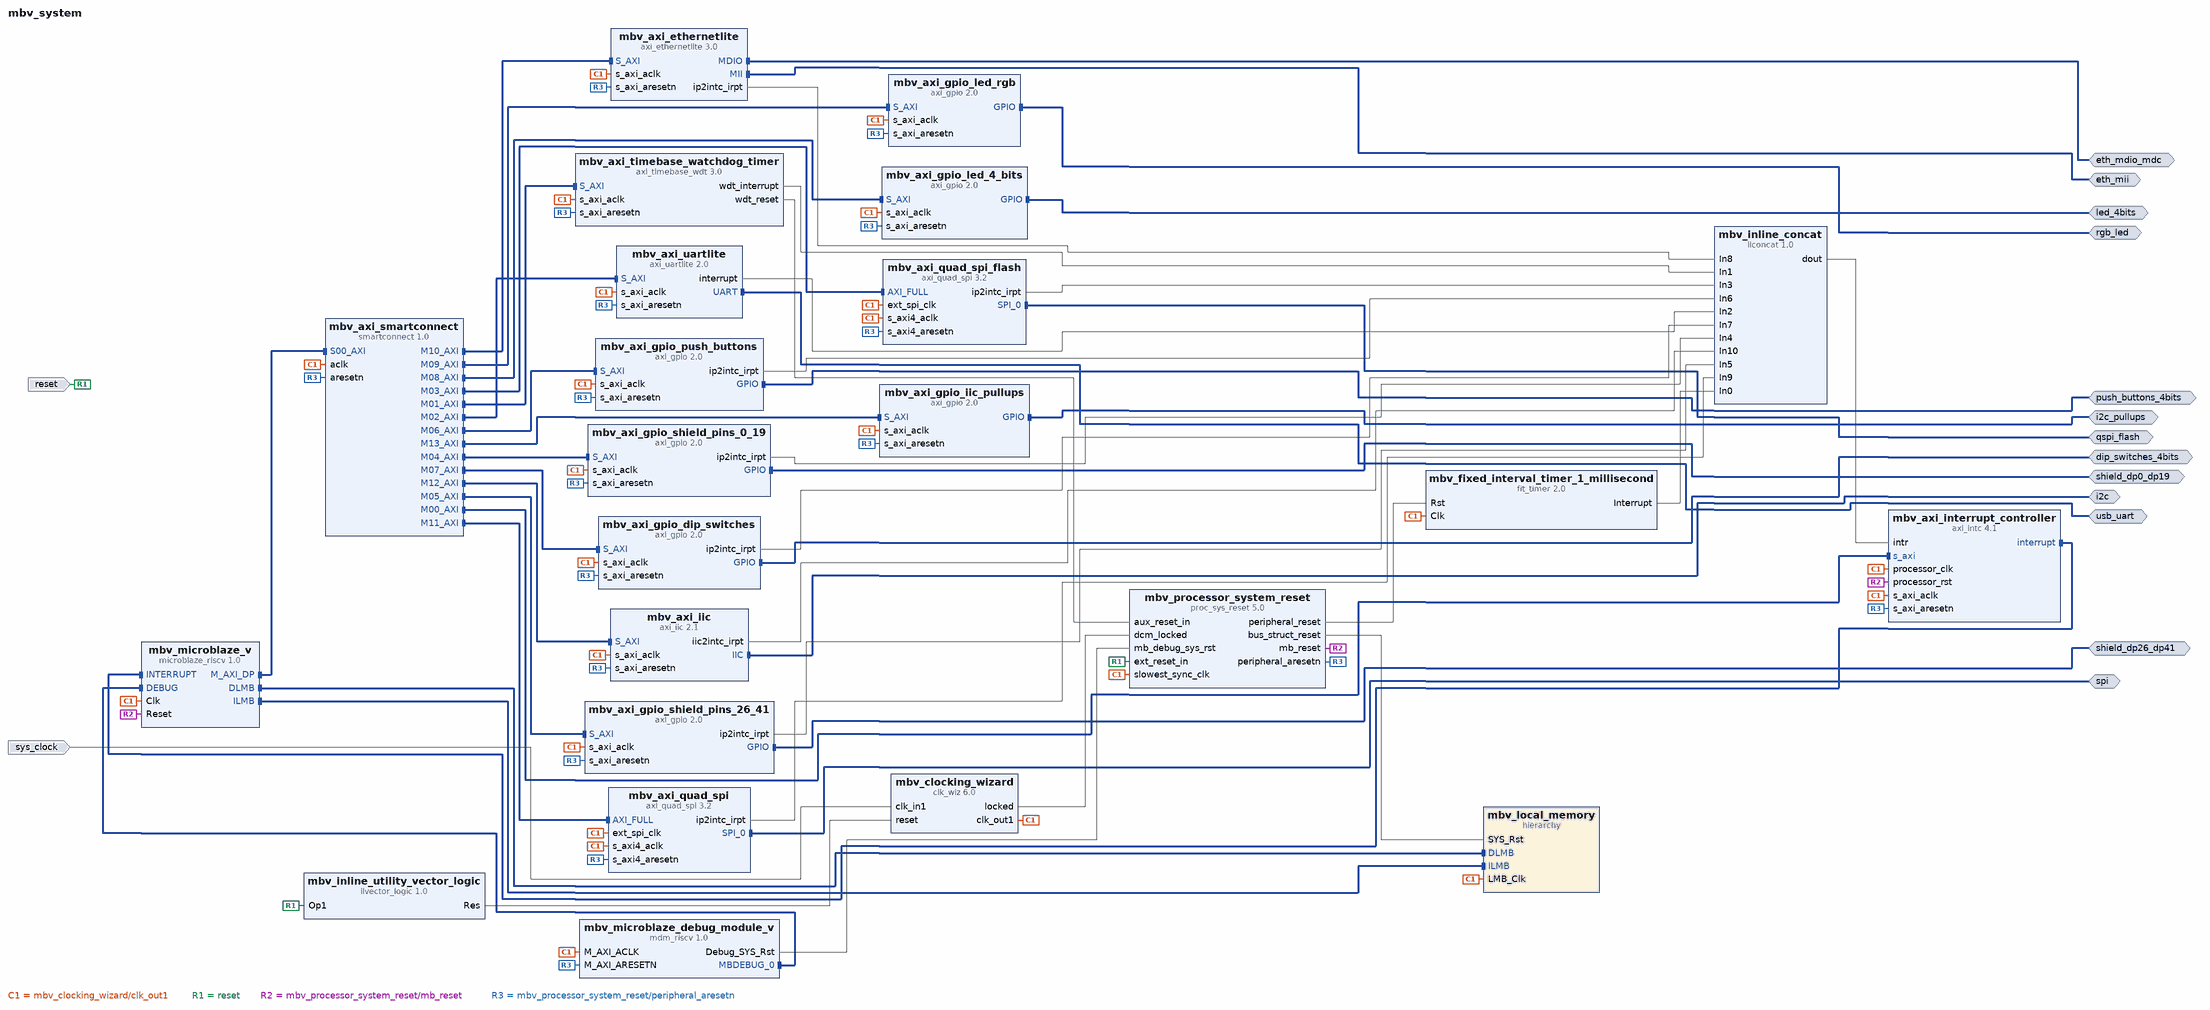
[diagram p0: block diagram of the top level]
# Vivado block design mbv_system, xc7a35ticsg324-1L, Vivado 2025.2
create_bd_design mbv_system

create_bd_intf_port -mode Master -vlnv xilinx.com:interface:uart_rtl:1.0 usb_uart
create_bd_intf_port -mode Master -vlnv xilinx.com:interface:spi_rtl:1.0 qspi_flash
create_bd_intf_port -mode Master -vlnv xilinx.com:interface:gpio_rtl:1.0 shield_dp0_dp19
create_bd_intf_port -mode Master -vlnv xilinx.com:interface:gpio_rtl:1.0 shield_dp26_dp41
create_bd_intf_port -mode Master -vlnv xilinx.com:interface:gpio_rtl:1.0 push_buttons_4bits
create_bd_intf_port -mode Master -vlnv xilinx.com:interface:gpio_rtl:1.0 dip_switches_4bits
create_bd_intf_port -mode Master -vlnv xilinx.com:interface:gpio_rtl:1.0 led_4bits
create_bd_intf_port -mode Master -vlnv xilinx.com:interface:gpio_rtl:1.0 rgb_led
create_bd_intf_port -mode Master -vlnv xilinx.com:interface:mii_rtl:1.0 eth_mii
create_bd_intf_port -mode Master -vlnv xilinx.com:interface:mdio_rtl:1.0 eth_mdio_mdc
create_bd_intf_port -mode Master -vlnv xilinx.com:interface:spi_rtl:1.0 spi
create_bd_intf_port -mode Master -vlnv xilinx.com:interface:iic_rtl:1.0 i2c
create_bd_intf_port -mode Master -vlnv xilinx.com:interface:gpio_rtl:1.0 i2c_pullups
create_bd_port -dir I -type clk sys_clock
set_property -dict {CONFIG.FREQ_HZ 100000000 CONFIG.PHASE 0.0} [get_bd_ports sys_clock]
create_bd_port -dir I -type rst reset
set_property -dict {CONFIG.POLARITY ACTIVE_LOW} [get_bd_ports reset]

create_bd_cell -type ip -vlnv xilinx.com:ip:microblaze_riscv:1.0 mbv_microblaze_v
set_property -dict [list \
  CONFIG.C_DEBUG_ENABLED 1 \
  CONFIG.C_DEBUG_EVENT_COUNTERS 13 \
  CONFIG.C_DEBUG_EXTERNAL_TRACE 1 \
  CONFIG.C_DEBUG_LATENCY_COUNTERS 8 \
  CONFIG.C_D_AXI 1 \
  CONFIG.C_D_LMB 1 \
  CONFIG.C_I_LMB 1 \
  CONFIG.C_NUMBER_OF_PC_BRK 8 \
  CONFIG.C_NUMBER_OF_RD_ADDR_BRK 4 \
  CONFIG.C_NUMBER_OF_WR_ADDR_BRK 4 \
  CONFIG.C_USE_ATOMIC 1 \
  CONFIG.C_USE_BITMAN_A 1 \
  CONFIG.C_USE_BITMAN_B 1 \
  CONFIG.C_USE_BITMAN_C 1 \
  CONFIG.C_USE_BITMAN_S 1 \
  CONFIG.C_USE_COMPRESSION 1 \
  CONFIG.C_USE_FPU 0 \
  CONFIG.C_USE_MMU 3 \
  CONFIG.C_USE_MULDIV 2 \
] [get_bd_cells mbv_microblaze_v]
create_bd_cell -type hier mbv_local_memory
create_bd_cell -type ip -vlnv xilinx.com:ip:smartconnect:1.0 mbv_axi_smartconnect
set_property -dict {CONFIG.NUM_MI 14 CONFIG.NUM_SI 1} [get_bd_cells mbv_axi_smartconnect]
create_bd_cell -type ip -vlnv xilinx.com:ip:axi_intc:4.1 mbv_axi_interrupt_controller
set_property -dict {CONFIG.C_HAS_FAST 1} [get_bd_cells mbv_axi_interrupt_controller]
create_bd_cell -type inline_hdl -vlnv xilinx.com:inline_hdl:ilconcat:1.0 mbv_inline_concat
set_property -dict {CONFIG.NUM_PORTS 11} [get_bd_cells mbv_inline_concat]
create_bd_cell -type ip -vlnv xilinx.com:ip:mdm_riscv:1.0 mbv_microblaze_debug_module_v
set_property -dict [list \
  CONFIG.C_ADDR_SIZE 34 \
  CONFIG.C_M_AXI_ADDR_WIDTH 34 \
  CONFIG.C_TRACE_DATA_WIDTH 16 \
  CONFIG.C_TRACE_OUTPUT 1 \
] [get_bd_cells mbv_microblaze_debug_module_v]
create_bd_cell -type ip -vlnv xilinx.com:ip:clk_wiz:6.0 mbv_clocking_wizard
set_property -dict [list \
  CONFIG.CLKOUT1_JITTER 226.435 \
  CONFIG.CLKOUT1_PHASE_ERROR 236.795 \
  CONFIG.CLKOUT1_REQUESTED_OUT_FREQ 75 \
  CONFIG.CLK_IN1_BOARD_INTERFACE sys_clock \
  CONFIG.MMCM_CLKFBOUT_MULT_F 40.125 \
  CONFIG.MMCM_CLKOUT0_DIVIDE_F 13.375 \
  CONFIG.MMCM_DIVCLK_DIVIDE 4 \
  CONFIG.PRIM_SOURCE Single_ended_clock_capable_pin \
  CONFIG.RESET_BOARD_INTERFACE reset \
  CONFIG.USE_BOARD_FLOW true \
] [get_bd_cells mbv_clocking_wizard]
create_bd_cell -type ip -vlnv xilinx.com:ip:proc_sys_reset:5.0 mbv_processor_system_reset
set_property -dict {CONFIG.RESET_BOARD_INTERFACE reset CONFIG.USE_BOARD_FLOW true} [get_bd_cells mbv_processor_system_reset]
create_bd_cell -type inline_hdl -vlnv xilinx.com:inline_hdl:ilvector_logic:1.0 mbv_inline_utility_vector_logic
set_property -dict {CONFIG.C_OPERATION not CONFIG.C_SIZE 1} [get_bd_cells mbv_inline_utility_vector_logic]
create_bd_cell -type ip -vlnv xilinx.com:ip:fit_timer:2.0 mbv_fixed_interval_timer_1_millisecond
set_property -dict {CONFIG.C_NO_CLOCKS 75000} [get_bd_cells mbv_fixed_interval_timer_1_millisecond]
create_bd_cell -type ip -vlnv xilinx.com:ip:axi_timebase_wdt:3.0 mbv_axi_timebase_watchdog_timer
set_property -dict {CONFIG.ENABLE_WINDOW_WDT 1} [get_bd_cells mbv_axi_timebase_watchdog_timer]
create_bd_cell -type ip -vlnv xilinx.com:ip:axi_uartlite:2.0 mbv_axi_uartlite
set_property -dict [list \
  CONFIG.C_BAUDRATE 115200 \
  CONFIG.UARTLITE_BOARD_INTERFACE usb_uart \
  CONFIG.USE_BOARD_FLOW true \
] [get_bd_cells mbv_axi_uartlite]
create_bd_cell -type ip -vlnv xilinx.com:ip:axi_quad_spi:3.2 mbv_axi_quad_spi_flash
set_property -dict [list \
  CONFIG.C_FIFO_DEPTH 256 \
  CONFIG.C_SPI_MEMORY 3 \
  CONFIG.C_TYPE_OF_AXI4_INTERFACE 1 \
  CONFIG.C_XIP_MODE 0 \
  CONFIG.QSPI_BOARD_INTERFACE qspi_flash \
  CONFIG.USE_BOARD_FLOW true \
] [get_bd_cells mbv_axi_quad_spi_flash]
create_bd_cell -type ip -vlnv xilinx.com:ip:axi_gpio:2.0 mbv_axi_gpio_shield_pins_0_19
set_property -dict [list \
  CONFIG.GPIO_BOARD_INTERFACE shield_dp0_dp19 \
  CONFIG.USE_BOARD_FLOW true \
] [get_bd_cells mbv_axi_gpio_shield_pins_0_19]
create_bd_cell -type ip -vlnv xilinx.com:ip:axi_gpio:2.0 mbv_axi_gpio_shield_pins_26_41
set_property -dict [list \
  CONFIG.C_INTERRUPT_PRESENT 1 \
  CONFIG.GPIO_BOARD_INTERFACE shield_dp26_dp41 \
  CONFIG.USE_BOARD_FLOW true \
] [get_bd_cells mbv_axi_gpio_shield_pins_26_41]
create_bd_cell -type ip -vlnv xilinx.com:ip:axi_gpio:2.0 mbv_axi_gpio_push_buttons
set_property -dict [list \
  CONFIG.C_INTERRUPT_PRESENT 1 \
  CONFIG.GPIO_BOARD_INTERFACE push_buttons_4bits \
  CONFIG.USE_BOARD_FLOW true \
] [get_bd_cells mbv_axi_gpio_push_buttons]
create_bd_cell -type ip -vlnv xilinx.com:ip:axi_gpio:2.0 mbv_axi_gpio_dip_switches
set_property -dict [list \
  CONFIG.C_INTERRUPT_PRESENT 1 \
  CONFIG.GPIO_BOARD_INTERFACE dip_switches_4bits \
  CONFIG.USE_BOARD_FLOW true \
] [get_bd_cells mbv_axi_gpio_dip_switches]
create_bd_cell -type ip -vlnv xilinx.com:ip:axi_gpio:2.0 mbv_axi_gpio_led_4_bits
set_property -dict {CONFIG.GPIO_BOARD_INTERFACE led_4bits CONFIG.USE_BOARD_FLOW true} [get_bd_cells mbv_axi_gpio_led_4_bits]
create_bd_cell -type ip -vlnv xilinx.com:ip:axi_gpio:2.0 mbv_axi_gpio_led_rgb
set_property -dict {CONFIG.GPIO_BOARD_INTERFACE rgb_led CONFIG.USE_BOARD_FLOW true} [get_bd_cells mbv_axi_gpio_led_rgb]
create_bd_cell -type ip -vlnv xilinx.com:ip:axi_ethernetlite:3.0 mbv_axi_ethernetlite
set_property -dict [list \
  CONFIG.C_S_AXI_PROTOCOL AXI4LITE \
  CONFIG.MDIO_BOARD_INTERFACE eth_mdio_mdc \
  CONFIG.MII_BOARD_INTERFACE eth_mii \
  CONFIG.USE_BOARD_FLOW true \
] [get_bd_cells mbv_axi_ethernetlite]
create_bd_cell -type ip -vlnv xilinx.com:ip:axi_quad_spi:3.2 mbv_axi_quad_spi
set_property -dict [list \
  CONFIG.C_BYTE_LEVEL_INTERRUPT_EN 0 \
  CONFIG.C_FIFO_DEPTH 256 \
  CONFIG.C_NUM_TRANSFER_BITS 32 \
  CONFIG.C_SCK_RATIO 16 \
  CONFIG.C_SPI_MEMORY 3 \
  CONFIG.C_SPI_MODE 0 \
  CONFIG.C_TYPE_OF_AXI4_INTERFACE 1 \
  CONFIG.QSPI_BOARD_INTERFACE spi \
  CONFIG.USE_BOARD_FLOW true \
] [get_bd_cells mbv_axi_quad_spi]
create_bd_cell -type ip -vlnv xilinx.com:ip:axi_iic:2.1 mbv_axi_iic
set_property -dict [list \
  CONFIG.C_SCL_INERTIAL_DELAY 4 \
  CONFIG.C_SDA_INERTIAL_DELAY 4 \
  CONFIG.IIC_BOARD_INTERFACE i2c \
  CONFIG.USE_BOARD_FLOW true \
] [get_bd_cells mbv_axi_iic]
create_bd_cell -type ip -vlnv xilinx.com:ip:axi_gpio:2.0 mbv_axi_gpio_iic_pullups
set_property -dict {CONFIG.GPIO_BOARD_INTERFACE i2c_pullups CONFIG.USE_BOARD_FLOW true} [get_bd_cells mbv_axi_gpio_iic_pullups]

# ---- hierarchy /mbv_local_memory ----
current_bd_instance /mbv_local_memory
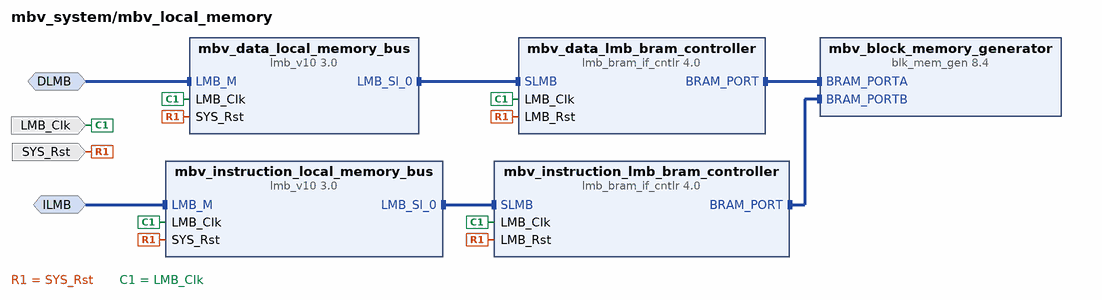
[diagram p1: block diagram inside /mbv_local_memory]
create_bd_intf_pin -mode MirroredMaster -vlnv xilinx.com:interface:lmb_rtl:1.0 DLMB
create_bd_intf_pin -mode MirroredMaster -vlnv xilinx.com:interface:lmb_rtl:1.0 ILMB
create_bd_pin -dir I -type clk LMB_Clk
create_bd_pin -dir I -type rst SYS_Rst

create_bd_cell -type ip -vlnv xilinx.com:ip:lmb_v10:3.0 mbv_data_local_memory_bus
create_bd_cell -type ip -vlnv xilinx.com:ip:lmb_v10:3.0 mbv_instruction_local_memory_bus
create_bd_cell -type ip -vlnv xilinx.com:ip:lmb_bram_if_cntlr:4.0 mbv_data_lmb_bram_controller
set_property -dict {CONFIG.C_ECC 0} [get_bd_cells mbv_data_lmb_bram_controller]
create_bd_cell -type ip -vlnv xilinx.com:ip:lmb_bram_if_cntlr:4.0 mbv_instruction_lmb_bram_controller
set_property -dict {CONFIG.C_ECC 0} [get_bd_cells mbv_instruction_lmb_bram_controller]
create_bd_cell -type ip -vlnv xilinx.com:ip:blk_mem_gen:8.4 mbv_block_memory_generator
set_property -dict [list \
  CONFIG.Memory_Type True_Dual_Port_RAM \
  CONFIG.use_bram_block BRAM_Controller \
] [get_bd_cells mbv_block_memory_generator]

# ---- connections ----

current_bd_instance /mbv_local_memory
connect_bd_intf_net -intf_net mbv_riscv_dlmb [get_bd_intf_pins mbv_data_local_memory_bus/LMB_M] [get_bd_intf_pins DLMB]
connect_bd_intf_net -intf_net mbv_riscv_dlmb_bus [get_bd_intf_pins mbv_data_local_memory_bus/LMB_Sl_0] [get_bd_intf_pins mbv_data_lmb_bram_controller/SLMB]
connect_bd_intf_net -intf_net mbv_riscv_dlmb_cntlr [get_bd_intf_pins mbv_data_lmb_bram_controller/BRAM_PORT] [get_bd_intf_pins mbv_block_memory_generator/BRAM_PORTA]
connect_bd_intf_net -intf_net mbv_riscv_ilmb [get_bd_intf_pins mbv_instruction_local_memory_bus/LMB_M] [get_bd_intf_pins ILMB]
connect_bd_intf_net -intf_net mbv_riscv_ilmb_bus [get_bd_intf_pins mbv_instruction_local_memory_bus/LMB_Sl_0] [get_bd_intf_pins mbv_instruction_lmb_bram_controller/SLMB]
connect_bd_intf_net -intf_net mbv_riscv_ilmb_cntlr [get_bd_intf_pins mbv_instruction_lmb_bram_controller/BRAM_PORT] [get_bd_intf_pins mbv_block_memory_generator/BRAM_PORTB]
connect_bd_net [get_bd_pins SYS_Rst] \
  [get_bd_pins mbv_data_local_memory_bus/SYS_Rst] [get_bd_pins mbv_data_lmb_bram_controller/LMB_Rst] \
  [get_bd_pins mbv_instruction_local_memory_bus/SYS_Rst] [get_bd_pins mbv_instruction_lmb_bram_controller/LMB_Rst]
connect_bd_net -net mbv_riscv_Clk [get_bd_pins LMB_Clk] \
  [get_bd_pins mbv_data_local_memory_bus/LMB_Clk] [get_bd_pins mbv_data_lmb_bram_controller/LMB_Clk] \
  [get_bd_pins mbv_instruction_local_memory_bus/LMB_Clk] [get_bd_pins mbv_instruction_lmb_bram_controller/LMB_Clk]
set_property HDL_ATTRIBUTE.BMM_INFO_ADDRESS_SPACE {byte  0x00000000 32 > mbv_system mbv_local_memory/mbv_block_memory_generator} [get_bd_cells mbv_data_lmb_bram_controller]
set_property HDL_ATTRIBUTE.KEEP_HIERARCHY yes [get_bd_cells mbv_data_lmb_bram_controller]

current_bd_instance /
connect_bd_intf_net -intf_net axi_ethernetlite_0_MDIO [get_bd_intf_ports eth_mdio_mdc] [get_bd_intf_pins mbv_axi_ethernetlite/MDIO]
connect_bd_intf_net -intf_net axi_ethernetlite_0_MII [get_bd_intf_ports eth_mii] [get_bd_intf_pins mbv_axi_ethernetlite/MII]
connect_bd_intf_net -intf_net axi_gpio_0_GPIO [get_bd_intf_ports shield_dp0_dp19] [get_bd_intf_pins mbv_axi_gpio_shield_pins_0_19/GPIO]
connect_bd_intf_net -intf_net axi_gpio_0_GPIO1 [get_bd_intf_ports push_buttons_4bits] [get_bd_intf_pins mbv_axi_gpio_push_buttons/GPIO]
connect_bd_intf_net -intf_net axi_gpio_0_GPIO2 [get_bd_intf_ports led_4bits] [get_bd_intf_pins mbv_axi_gpio_led_4_bits/GPIO]
connect_bd_intf_net -intf_net axi_gpio_0_GPIO3 [get_bd_intf_ports rgb_led] [get_bd_intf_pins mbv_axi_gpio_led_rgb/GPIO]
connect_bd_intf_net -intf_net axi_iic_0_IIC [get_bd_intf_ports i2c] [get_bd_intf_pins mbv_axi_iic/IIC]
connect_bd_intf_net -intf_net axi_quad_spi_0_SPI_0 [get_bd_intf_ports qspi_flash] [get_bd_intf_pins mbv_axi_quad_spi_flash/SPI_0]
connect_bd_intf_net -intf_net axi_quad_spi_0_SPI_1 [get_bd_intf_ports spi] [get_bd_intf_pins mbv_axi_quad_spi/SPI_0]
connect_bd_intf_net -intf_net axi_uartlite_0_UART [get_bd_intf_ports usb_uart] [get_bd_intf_pins mbv_axi_uartlite/UART]
connect_bd_intf_net [get_bd_intf_ports dip_switches_4bits] [get_bd_intf_pins mbv_axi_gpio_dip_switches/GPIO]
connect_bd_intf_net [get_bd_intf_ports i2c_pullups] [get_bd_intf_pins mbv_axi_gpio_iic_pullups/GPIO]
connect_bd_intf_net [get_bd_intf_ports shield_dp26_dp41] [get_bd_intf_pins mbv_axi_gpio_shield_pins_26_41/GPIO]
connect_bd_intf_net [get_bd_intf_pins mbv_axi_smartconnect/M01_AXI] [get_bd_intf_pins mbv_axi_timebase_watchdog_timer/S_AXI]
connect_bd_intf_net [get_bd_intf_pins mbv_axi_smartconnect/M02_AXI] [get_bd_intf_pins mbv_axi_uartlite/S_AXI]
connect_bd_intf_net [get_bd_intf_pins mbv_axi_smartconnect/M03_AXI] [get_bd_intf_pins mbv_axi_quad_spi_flash/AXI_FULL]
connect_bd_intf_net [get_bd_intf_pins mbv_axi_smartconnect/M04_AXI] [get_bd_intf_pins mbv_axi_gpio_shield_pins_0_19/S_AXI]
connect_bd_intf_net [get_bd_intf_pins mbv_axi_smartconnect/M05_AXI] [get_bd_intf_pins mbv_axi_gpio_shield_pins_26_41/S_AXI]
connect_bd_intf_net [get_bd_intf_pins mbv_axi_smartconnect/M06_AXI] [get_bd_intf_pins mbv_axi_gpio_push_buttons/S_AXI]
connect_bd_intf_net [get_bd_intf_pins mbv_axi_smartconnect/M07_AXI] [get_bd_intf_pins mbv_axi_gpio_dip_switches/S_AXI]
connect_bd_intf_net [get_bd_intf_pins mbv_axi_smartconnect/M08_AXI] [get_bd_intf_pins mbv_axi_gpio_led_4_bits/S_AXI]
connect_bd_intf_net [get_bd_intf_pins mbv_axi_smartconnect/M09_AXI] [get_bd_intf_pins mbv_axi_gpio_led_rgb/S_AXI]
connect_bd_intf_net [get_bd_intf_pins mbv_axi_smartconnect/M10_AXI] [get_bd_intf_pins mbv_axi_ethernetlite/S_AXI]
connect_bd_intf_net [get_bd_intf_pins mbv_axi_smartconnect/M11_AXI] [get_bd_intf_pins mbv_axi_quad_spi/AXI_FULL]
connect_bd_intf_net [get_bd_intf_pins mbv_axi_smartconnect/M12_AXI] [get_bd_intf_pins mbv_axi_iic/S_AXI]
connect_bd_intf_net [get_bd_intf_pins mbv_axi_smartconnect/M13_AXI] [get_bd_intf_pins mbv_axi_gpio_iic_pullups/S_AXI]
connect_bd_intf_net -intf_net mbv_riscv_axi_dp [get_bd_intf_pins mbv_axi_smartconnect/S00_AXI] [get_bd_intf_pins mbv_microblaze_v/M_AXI_DP]
connect_bd_intf_net -intf_net mbv_riscv_debug [get_bd_intf_pins mbv_microblaze_debug_module_v/MBDEBUG_0] [get_bd_intf_pins mbv_microblaze_v/DEBUG]
connect_bd_intf_net -intf_net mbv_riscv_dlmb_1 [get_bd_intf_pins mbv_microblaze_v/DLMB] [get_bd_intf_pins mbv_local_memory/DLMB]
connect_bd_intf_net -intf_net mbv_riscv_ilmb_1 [get_bd_intf_pins mbv_microblaze_v/ILMB] [get_bd_intf_pins mbv_local_memory/ILMB]
connect_bd_intf_net -intf_net mbv_riscv_intc_axi [get_bd_intf_pins mbv_axi_smartconnect/M00_AXI] [get_bd_intf_pins mbv_axi_interrupt_controller/s_axi]
connect_bd_intf_net -intf_net mbv_riscv_interrupt [get_bd_intf_pins mbv_axi_interrupt_controller/interrupt] [get_bd_intf_pins mbv_microblaze_v/INTERRUPT]
connect_bd_net -net axi_ethernetlite_0_ip2intc_irpt [get_bd_pins mbv_axi_ethernetlite/ip2intc_irpt] [get_bd_pins mbv_inline_concat/In8]
connect_bd_net -net axi_gpio_0_ip2intc_irpt [get_bd_pins mbv_axi_gpio_push_buttons/ip2intc_irpt] [get_bd_pins mbv_inline_concat/In6]
connect_bd_net -net axi_iic_0_iic2intc_irpt [get_bd_pins mbv_axi_iic/iic2intc_irpt] [get_bd_pins mbv_inline_concat/In10]
connect_bd_net -net axi_quad_spi_0_ip2intc_irpt [get_bd_pins mbv_axi_quad_spi/ip2intc_irpt] [get_bd_pins mbv_inline_concat/In9]
connect_bd_net -net axi_timebase_watchdog_timer_wdt_interrupt [get_bd_pins mbv_axi_timebase_watchdog_timer/wdt_interrupt] \
  [get_bd_pins mbv_inline_concat/In1]
connect_bd_net -net axi_timebase_watchdog_timer_wdt_reset [get_bd_pins mbv_axi_timebase_watchdog_timer/wdt_reset] \
  [get_bd_pins mbv_processor_system_reset/aux_reset_in]
connect_bd_net -net clk_wiz_1_locked [get_bd_pins mbv_clocking_wizard/locked] [get_bd_pins mbv_processor_system_reset/dcm_locked]
connect_bd_net [get_bd_pins mbv_axi_gpio_dip_switches/ip2intc_irpt] [get_bd_pins mbv_inline_concat/In7]
connect_bd_net [get_bd_pins mbv_axi_gpio_shield_pins_0_19/ip2intc_irpt] [get_bd_pins mbv_inline_concat/In4]
connect_bd_net [get_bd_pins mbv_axi_gpio_shield_pins_26_41/ip2intc_irpt] [get_bd_pins mbv_inline_concat/In5]
connect_bd_net -net mbv_axi_quad_spi_ip2intc_irpt [get_bd_pins mbv_axi_quad_spi_flash/ip2intc_irpt] [get_bd_pins mbv_inline_concat/In3]
connect_bd_net [get_bd_pins mbv_axi_uartlite/interrupt] [get_bd_pins mbv_inline_concat/In2]
connect_bd_net -net mbv_fixed_interval_timer_Interrupt [get_bd_pins mbv_fixed_interval_timer_1_millisecond/Interrupt] \
  [get_bd_pins mbv_inline_concat/In0]
connect_bd_net [get_bd_pins mbv_processor_system_reset/peripheral_reset] [get_bd_pins mbv_fixed_interval_timer_1_millisecond/Rst]
connect_bd_net -net mbv_riscv_Clk [get_bd_pins mbv_clocking_wizard/clk_out1] \
  [get_bd_pins mbv_microblaze_v/Clk] [get_bd_pins mbv_axi_smartconnect/aclk] \
  [get_bd_pins mbv_axi_interrupt_controller/s_axi_aclk] [get_bd_pins mbv_axi_interrupt_controller/processor_clk] \
  [get_bd_pins mbv_local_memory/LMB_Clk] [get_bd_pins mbv_processor_system_reset/slowest_sync_clk] \
  [get_bd_pins mbv_microblaze_debug_module_v/M_AXI_ACLK] [get_bd_pins mbv_fixed_interval_timer_1_millisecond/Clk] \
  [get_bd_pins mbv_axi_timebase_watchdog_timer/s_axi_aclk] [get_bd_pins mbv_axi_uartlite/s_axi_aclk] \
  [get_bd_pins mbv_axi_quad_spi_flash/ext_spi_clk] [get_bd_pins mbv_axi_gpio_shield_pins_0_19/s_axi_aclk] \
  [get_bd_pins mbv_axi_gpio_shield_pins_26_41/s_axi_aclk] [get_bd_pins mbv_axi_gpio_push_buttons/s_axi_aclk] \
  [get_bd_pins mbv_axi_gpio_dip_switches/s_axi_aclk] [get_bd_pins mbv_axi_gpio_led_4_bits/s_axi_aclk] \
  [get_bd_pins mbv_axi_gpio_led_rgb/s_axi_aclk] [get_bd_pins mbv_axi_ethernetlite/s_axi_aclk] \
  [get_bd_pins mbv_axi_quad_spi_flash/s_axi4_aclk] [get_bd_pins mbv_axi_quad_spi/s_axi4_aclk] \
  [get_bd_pins mbv_axi_quad_spi/ext_spi_clk] [get_bd_pins mbv_axi_iic/s_axi_aclk] \
  [get_bd_pins mbv_axi_gpio_iic_pullups/s_axi_aclk]
connect_bd_net -net mbv_riscv_intr [get_bd_pins mbv_inline_concat/dout] [get_bd_pins mbv_axi_interrupt_controller/intr]
connect_bd_net -net mdm_1_debug_sys_rst [get_bd_pins mbv_microblaze_debug_module_v/Debug_SYS_Rst] \
  [get_bd_pins mbv_processor_system_reset/mb_debug_sys_rst]
connect_bd_net [get_bd_ports reset] [get_bd_pins mbv_inline_utility_vector_logic/Op1] [get_bd_pins mbv_processor_system_reset/ext_reset_in]
connect_bd_net -net reset_inv_0_Res [get_bd_pins mbv_inline_utility_vector_logic/Res] [get_bd_pins mbv_clocking_wizard/reset]
connect_bd_net -net rst_clk_wiz_1_100M_bus_struct_reset [get_bd_pins mbv_processor_system_reset/bus_struct_reset] \
  [get_bd_pins mbv_local_memory/SYS_Rst]
connect_bd_net -net rst_clk_wiz_1_100M_mb_reset [get_bd_pins mbv_processor_system_reset/mb_reset] \
  [get_bd_pins mbv_microblaze_v/Reset] [get_bd_pins mbv_axi_interrupt_controller/processor_rst]
connect_bd_net -net rst_clk_wiz_1_100M_peripheral_aresetn [get_bd_pins mbv_processor_system_reset/peripheral_aresetn] \
  [get_bd_pins mbv_axi_smartconnect/aresetn] [get_bd_pins mbv_axi_interrupt_controller/s_axi_aresetn] \
  [get_bd_pins mbv_microblaze_debug_module_v/M_AXI_ARESETN] [get_bd_pins mbv_axi_timebase_watchdog_timer/s_axi_aresetn] \
  [get_bd_pins mbv_axi_uartlite/s_axi_aresetn] [get_bd_pins mbv_axi_gpio_shield_pins_0_19/s_axi_aresetn] \
  [get_bd_pins mbv_axi_gpio_shield_pins_26_41/s_axi_aresetn] [get_bd_pins mbv_axi_gpio_push_buttons/s_axi_aresetn] \
  [get_bd_pins mbv_axi_gpio_dip_switches/s_axi_aresetn] [get_bd_pins mbv_axi_gpio_led_4_bits/s_axi_aresetn] \
  [get_bd_pins mbv_axi_gpio_led_rgb/s_axi_aresetn] [get_bd_pins mbv_axi_ethernetlite/s_axi_aresetn] \
  [get_bd_pins mbv_axi_quad_spi_flash/s_axi4_aresetn] [get_bd_pins mbv_axi_quad_spi/s_axi4_aresetn] \
  [get_bd_pins mbv_axi_iic/s_axi_aresetn] [get_bd_pins mbv_axi_gpio_iic_pullups/s_axi_aresetn]
connect_bd_net [get_bd_ports sys_clock] [get_bd_pins mbv_clocking_wizard/clk_in1]
set_property HDL_ATTRIBUTE.BMM_INFO_PROCESSOR {riscv > mbv_system mbv_local_memory/mbv_data_lmb_bram_controller} [get_bd_cells mbv_microblaze_v]
set_property HDL_ATTRIBUTE.KEEP_HIERARCHY yes [get_bd_cells mbv_microblaze_v]

# ---- address map ----
assign_bd_address -offset 0x000000000 -range 128K -target_address_space [get_bd_addr_spaces mbv_microblaze_v/Data] [get_bd_addr_segs mbv_local_memory/mbv_data_lmb_bram_controller/SLMB/Mem]
assign_bd_address -offset 0x040000000 -range 64K -target_address_space [get_bd_addr_spaces mbv_microblaze_v/Data] [get_bd_addr_segs mbv_axi_gpio_shield_pins_0_19/S_AXI/Reg]
assign_bd_address -offset 0x040010000 -range 64K -target_address_space [get_bd_addr_spaces mbv_microblaze_v/Data] [get_bd_addr_segs mbv_axi_gpio_shield_pins_26_41/S_AXI/Reg]
assign_bd_address -offset 0x040020000 -range 64K -target_address_space [get_bd_addr_spaces mbv_microblaze_v/Data] [get_bd_addr_segs mbv_axi_gpio_push_buttons/S_AXI/Reg]
assign_bd_address -offset 0x040030000 -range 64K -target_address_space [get_bd_addr_spaces mbv_microblaze_v/Data] [get_bd_addr_segs mbv_axi_gpio_dip_switches/S_AXI/Reg]
assign_bd_address -offset 0x040040000 -range 64K -target_address_space [get_bd_addr_spaces mbv_microblaze_v/Data] [get_bd_addr_segs mbv_axi_gpio_led_4_bits/S_AXI/Reg]
assign_bd_address -offset 0x040050000 -range 64K -target_address_space [get_bd_addr_spaces mbv_microblaze_v/Data] [get_bd_addr_segs mbv_axi_gpio_led_rgb/S_AXI/Reg]
assign_bd_address -offset 0x040060000 -range 64K -target_address_space [get_bd_addr_spaces mbv_microblaze_v/Data] [get_bd_addr_segs mbv_axi_gpio_iic_pullups/S_AXI/Reg]
assign_bd_address -offset 0x040600000 -range 64K -target_address_space [get_bd_addr_spaces mbv_microblaze_v/Data] [get_bd_addr_segs mbv_axi_uartlite/S_AXI/Reg]
assign_bd_address -offset 0x040800000 -range 64K -target_address_space [get_bd_addr_spaces mbv_microblaze_v/Data] [get_bd_addr_segs mbv_axi_iic/S_AXI/Reg]
assign_bd_address -offset 0x040E00000 -range 64K -target_address_space [get_bd_addr_spaces mbv_microblaze_v/Data] [get_bd_addr_segs mbv_axi_ethernetlite/S_AXI/Reg]
assign_bd_address -offset 0x041200000 -range 64K -target_address_space [get_bd_addr_spaces mbv_microblaze_v/Data] [get_bd_addr_segs mbv_axi_interrupt_controller/S_AXI/Reg]
assign_bd_address -offset 0x041A00000 -range 64K -target_address_space [get_bd_addr_spaces mbv_microblaze_v/Data] [get_bd_addr_segs mbv_axi_timebase_watchdog_timer/S_AXI/Reg]
assign_bd_address -offset 0x044A00000 -range 64K -target_address_space [get_bd_addr_spaces mbv_microblaze_v/Data] [get_bd_addr_segs mbv_axi_quad_spi_flash/aximm/MEM0]
assign_bd_address -offset 0x044A10000 -range 64K -target_address_space [get_bd_addr_spaces mbv_microblaze_v/Data] [get_bd_addr_segs mbv_axi_quad_spi/aximm/MEM0]
assign_bd_address -offset 0x000000000 -range 128K -target_address_space [get_bd_addr_spaces mbv_microblaze_v/Instruction] [get_bd_addr_segs mbv_local_memory/mbv_instruction_lmb_bram_controller/SLMB/Mem]

validate_bd_design
save_bd_design
